# Altium schematic sheet ADS_2.SchDoc
size A
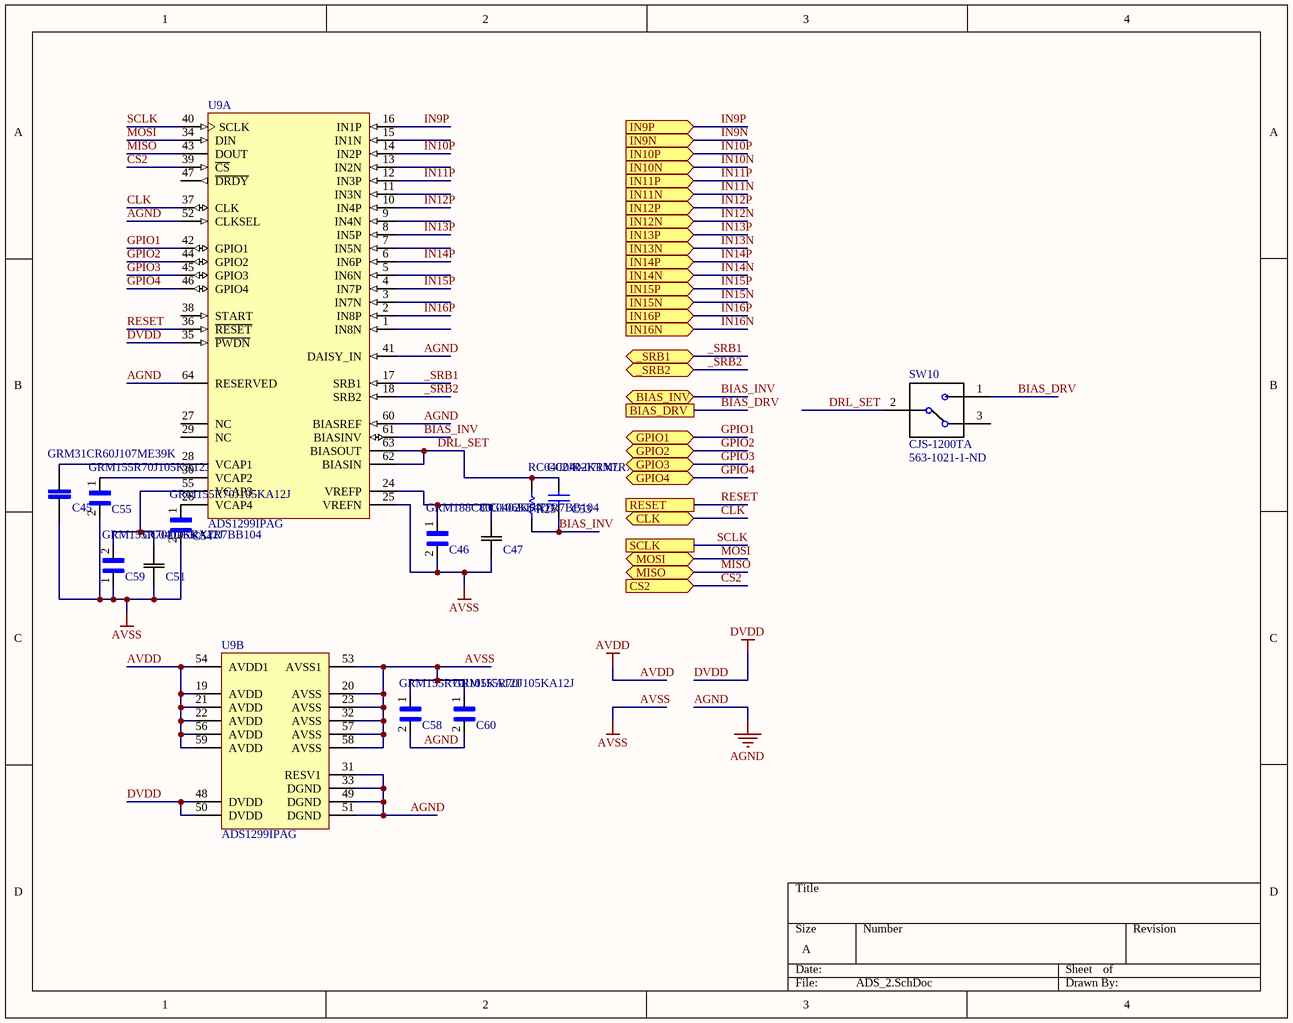
[diagram p0: ADS_2.SchDoc]

## Parts
C45  GRM31CR60J107ME39K  [*CAPC3216X190]
C46  GRM188C80G106KE47D  [*CAPC1608X90N]
C47  CC0402KRX7R7BB104  [YAG_CC0402]
C51  CC0402KRX7R7BB104  [YAG_CC0402]
C53  CC0402KRX7R7BB102  [CAPC1005X55X23NL05T08]
C54  GRM155R70J105KA12J  [*CAPC1005X55N]
C55  GRM155R70J105KA12J  [*CAPC1005X55N]
C58  GRM155R70J105KA12J  [*CAPC1005X55N]
C59  GRM155R70J105KA12J  [*CAPC1005X55N]
C60  GRM155R70J105KA12J  [*CAPC1005X55N]
R25  RC0402JR-071ML  [RESC1005X40X25NL05T10]
SW10  CJS-1200TA  Supplier Part Number 1: 563-1021-1-ND  [*SW_CJS-1200TA]
U9  ADS1299IPAG  [PAG0064A_N]  (parts A,B of 2)

## Ports
_SRB1 (bidir), _SRB2 (bidir), BIAS_DRV, BIAS_INV (bidir), CLK (bidir), CS2 (in), GPIO1 (bidir), GPIO2 (bidir), GPIO3 (bidir), GPIO4 (bidir), IN9N (in), IN9P (in), IN10N (in), IN10P (in), IN11N (in), IN11P (in), IN12N (in), IN12P (in), IN13N (in), IN13P (in), IN14N (in), IN14P (in), IN15N (in), IN15P (in), IN16N (in), IN16P (in), MISO (bidir), MOSI (bidir), RESET, SCLK

## Nets
AGND: C58.2 C60.2 U9.31(RESV1) U9.33(DGND) U9.41(DAISY_IN) U9.49(DGND) U9.51(DGND) U9.52(CLKSEL) U9.60(BIASREF) U9.64(RESERVED)
AVDD: U9.19(AVDD) U9.21(AVDD) U9.22(AVDD) U9.54(AVDD1) U9.56(AVDD) U9.59(AVDD)
AVSS: C45.2 C46.2 C47.2 C51.1 C54.2 C55.2 C58.1 C59.1 C60.1 U9.20(AVSS) U9.23(AVSS) U9.25(VREFN) U9.32(AVSS) U9.53(AVSS1) U9.57(AVSS) U9.58(AVSS)
DVDD: U9.35(~{PWDN}) U9.48(DVDD) U9.50(DVDD)
_SRB1: U9.17(SRB1) ; port _SRB1
_SRB2: U9.18(SRB2) ; port _SRB2
BIAS_DRV: SW10.1 ; port BIAS_DRV
BIAS_INV: C53.2 R25.2 U9.61(BIASINV) ; port BIAS_INV
CLK: U9.37(CLK) ; port CLK
CS2: U9.39(~{CS}) ; port CS2
DRL_SET: C53.1 R25.1 SW10.2 U9.62(BIASIN) U9.63(BIASOUT)
GPIO1: U9.42(GPIO1) ; port GPIO1
GPIO2: U9.44(GPIO2) ; port GPIO2
GPIO3: U9.45(GPIO3) ; port GPIO3
GPIO4: U9.46(GPIO4) ; port GPIO4
IN9N: port IN9N
IN9P: U9.16(IN1P) ; port IN9P
IN10N: port IN10N
IN10P: U9.14(IN2P) ; port IN10P
IN11N: port IN11N
IN11P: U9.12(IN3P) ; port IN11P
IN12N: port IN12N
IN12P: U9.10(IN4P) ; port IN12P
IN13N: port IN13N
IN13P: U9.8(IN5P) ; port IN13P
IN14N: port IN14N
IN14P: U9.6(IN6P) ; port IN14P
IN15N: port IN15N
IN15P: U9.4(IN7P) ; port IN15P
IN16N: port IN16N
IN16P: U9.2(IN8P) ; port IN16P
MISO: U9.43(DOUT) ; port MISO
MOSI: U9.34(DIN) ; port MOSI
RESET: U9.36(~{RESET}) ; port RESET
SCLK: U9.40(SCLK) ; port SCLK
NetC45_1: C45.1 U9.28(VCAP1)
NetC46_1: C46.1 C47.1 U9.24(VREFP)
NetC51_2: C51.2 C59.2 U9.55(VCAP3)
NetC54_1: C54.1 U9.26(VCAP4)
NetC55_1: C55.1 U9.30(VCAP2)

Not connected (* = marked no-connect by the designer): SW10 3; U9 1(IN8N) 3(IN7N) 5(IN6N) 7(IN5N) 9(IN4N) 11(IN3N) 13(IN2N) 15(IN1N) 27(NC) 29(NC) 38(START) 47(~{DRDY})

## Library data of the parts
C45 = GRM31CR60J107ME39K: MURATA - GRM31CR60J107ME39K - COND, 100µF, 6.3V, 20%, X5R, 1206; Capacitance: 100uF; Supplier 1: Digi-Key; Manufacturer 1: Murata; Manufacturer Part Number 1: GRM31CR60J107ME39K; Stock 1: 407390; Pricing 1: 1=0.98000, 10=0.77400, 100=0.58060, 500=0.43870, 1000=0.38709, 2500=0.36128 (USD); RoHS: Yes; Mount: Surface Mount; Case/Package: 1206; Case Code (Imperial): 1206; Case Code (Metric): 3216; Min Operating Temperature: -55°C; Max Operating Temperature: 85°C; Tolerance: 20%; Packaging: Tape and Reel; Package Quantity: 1; Voltage Rating: 6.3V; Dielectric: X5R; Termination: SMD/SMT; Voltage: 6.3V; Voltage Rating (DC): 6.3V; Length: 3.2mm; Height: 1.6mm; Width: 0.063inch; Thickness: 0.071inch; Depth: 1.6mm; Radiation Hardening: No; REACH SVHC: No SVHC; Lead Free: Lead Free; ComponentLink1URL: https://datasheet.ciiva.com/13246/product-13246228.pdf?src-supplier=Mouser; ComponentLink1Description: https://datasheet.ciiva.com/13246/product-13246228.pdf?src-supplier=Mouser; ComponentLink2URL: https://datasheet.ciiva.com/18697/grm31cr60j107me39-01-18697367.pdf?src-supplier=Digi-Key; ComponentLink2Description: https://datasheet.ciiva.com/18697/grm31cr60j107me39-01-18697367.pdf?src-supplier=Digi-Key; ComponentLink3URL: https://datasheet.ciiva.com/18697/grm31cr60j107me39-01-18697368.pdf?src-supplier=Digi-Key; ComponentLink3Description: https://datasheet.ciiva.com/18697/grm31cr60j107me39-01-18697368.pdf?src-supplier=Digi-Key; ComponentLink4URL: https://datasheet.ciiva.com/18697/grm31cr60j107me39-01-18697369.pdf?src-supplier=Digi-Key; ComponentLink4Description: https://datasheet.ciiva.com/18697/grm31cr60j107me39-01-18697369.pdf?src-supplier=Digi-Key; Supplier Part Number 1: 490-7217-1-ND
C46 = GRM188C80G106KE47D: CAP CER 10UF 4V X6S 0603; Manufacturer 1: Murata; Tolerance: 10%; Supplier 1: Digi-Key; Manufacturer Part Number 1: GRM188C80G106KE47D; Stock 1: 203819; Pricing 1: 1=0.17000, 10=0.11800, 100=0.05990, 500=0.04098, 1000=0.03625 (USD); RoHS: Yes; Mount: Surface Mount; Case/Package: 0603; Weight: 0.000222oz; Case Code (Metric): 1608; Case Code (Imperial): 0603; Min Operating Temperature: -55°C; Max Operating Temperature: 105°C; Capacitance: 10uF; Packaging: Tape and Reel; Voltage Rating: 4V; Dielectric: X6S; Termination: SMD/SMT; Voltage Rating (DC): 4V; Package Quantity: 4000; Length: 0.063inch; Height: 0.8mm; Width: 0.031inch; Thickness: 0.035inch; ComponentLink1URL: http://www.mouser.com/ds/2/281/c02e-2905.pdf?src-supplier=Mouser; ComponentLink1Description: http://www.mouser.com/ds/2/281/c02e-2905.pdf?src-supplier=Mouser; ComponentLink2URL: http://search.murata.co.jp/Ceramy/image/img/A01X/G101/ENG/GRM188C80G106KE47-01.pdf?src-supplier=Digi-Key; ComponentLink2Description: http://search.murata.co.jp/Ceramy/image/img/A01X/G101/ENG/GRM188C80G106KE47-01.pdf?src-supplier=Digi-Key; Supplier Part Number 1: 490-10469-1-ND
C47 C51 = CC0402KRX7R7BB104: CAP CER 0.1UF 16V X7R 0402; Manufacturer 1: Yageo; Capacitance: 100nF; Tolerance: 10%; Supplier 1: Digi-Key; Manufacturer Part Number 1: CC0402KRX7R7BB104; Stock 1: 30032352; Pricing 1: 1=0.10000, 10=0.03200, 100=0.01420, 500=0.01014, 1000=0.00797, 2500=0.00724, 5000=0.00667 (USD); RoHS: Yes; Mount: Surface Mount; Case/Package: 0402; Number of Pins: 2; Case Code (Metric): 1005; Case Code (Imperial): 0402; Min Operating Temperature: -55°C; Max Operating Temperature: 125°C; Voltage Rating: 16V; Voltage Rating (DC): 16V; Packaging: Tape and Reel; Package Quantity: 1; Dielectric: X7R; Termination: SMD/SMT; Composition: Ceramic; Voltage: 16V; Length: 1mm; Height: 0.5mm; Width: 0.02inch; Thickness: 0.022inch; Depth: 0.5mm; Radiation Hardening: No; REACH SVHC: No SVHC; Lead Free: Lead Free; Halogen Free: Halogen Free; ComponentLink1URL: https://datasheet.ciiva.com/11788/0900766b80ce67ed-11788364.pdf?src-supplier=RSComponents; ComponentLink1Description: https://datasheet.ciiva.com/11788/0900766b80ce67ed-11788364.pdf?src-supplier=RSComponents; ComponentLink2URL: https://datasheet.ciiva.com/16625/upy-gphc-x7r-6-3v-to-50v-8-16625511.pdf?src-supplier=Avnet+Europe; ComponentLink2Description: https://datasheet.ciiva.com/16625/upy-gphc-x7r-6-3v-to-50v-8-16625511.pdf?src-supplier=Avnet+Europe; ComponentLink3URL: https://datasheet.ciiva.com/161/mlccorderingcode-161544.pdf?src-supplier=Digi-Key; ComponentLink3Description: https://datasheet.ciiva.com/161/mlccorderingcode-161544.pdf?src-supplier=Digi-Key; ComponentLink4URL: https://datasheet.ciiva.com/161/mlccorderingcode-161545.pdf?src-supplier=Digi-Key; ComponentLink4Description: https://datasheet.ciiva.com/161/mlccorderingcode-161545.pdf?src-supplier=Digi-Key; ComponentLink5URL: https://datasheet.ciiva.com/8033/1734573-8033661.pdf?src-supplier=Element14; ComponentLink5Description: https://datasheet.ciiva.com/8033/1734573-8033661.pdf?src-supplier=Element14; ComponentLink6URL: https://datasheet.ciiva.com/7978/1489800-7978111.pdf?src-supplier=Element14; ComponentLink6Description: https://datasheet.ciiva.com/7978/1489800-7978111.pdf?src-supplier=Element14; ComponentLink7URL: https://datasheet.ciiva.com/8033/1734573-8033663.pdf?src-supplier=Element14; ComponentLink7Description: https://datasheet.ciiva.com/8033/1734573-8033663.pdf?src-supplier=Element14; ComponentLink8URL: https://datasheet.ciiva.com/11587/upy-gphc-x7r-6-3v-to-50v-8-11587305.pdf?src-supplier=Avnet; ComponentLink8Description: https://datasheet.ciiva.com/11587/upy-gphc-x7r-6-3v-to-50v-8-11587305.pdf?src-supplier=Avnet; ComponentLink9URL: https://datasheet.ciiva.com/161/mlccorderingcode-161546.pdf?src-supplier=Digi-Key; ComponentLink9Description: https://datasheet.ciiva.com/161/mlccorderingcode-161546.pdf?src-supplier=Digi-Key; ComponentLink10URL: https://datasheet.ciiva.com/13395/upy-gphc-x7r-6-3v-to-50v-8-13395676.pdf?src-supplier=Mouser; ComponentLink10Description: https://datasheet.ciiva.com/13395/upy-gphc-x7r-6-3v-to-50v-8-13395676.pdf?src-supplier=Mouser; ComponentLink11URL: https://datasheet.ciiva.com/28450/1489800-28450335.pdf?src-supplier=Element14; ComponentLink11Description: https://datasheet.ciiva.com/28450/1489800-28450335.pdf?src-supplier=Element14; Supplier Part Number 1: 311-1338-1-ND
C53 = CC0402KRX7R7BB102: CAP CER 1000PF 16V X7R 0402; Manufacturer 1: Yageo; Capacitance: 1nF; Tolerance: 10%; Supplier 1: Digi-Key; Manufacturer Part Number 1: CC0402KRX7R7BB102; Stock 1: 319318; Pricing 1: 1=0.10000, 10=0.02000, 100=0.00910, 500=0.00646, 1000=0.00508, 2500=0.00462, 5000=0.00425 (USD); RoHS: Yes; Mount: Surface Mount; Case/Package: 0402; Case Code (Imperial): 0402; Case Code (Metric): 1005; Min Operating Temperature: -55°C; Max Operating Temperature: 125°C; Packaging: Tape and Reel; Voltage Rating: 16V; Voltage Rating (DC): 16V; Package Quantity: 1; Dielectric: X7R; Termination: SMD/SMT; Composition: Ceramic; Length: 1mm; Height: 0.5mm; Width: 0.5mm; Thickness: 0.022inch; Depth: 0.5mm; Radiation Hardening: No; REACH SVHC: No SVHC; Lead Free: Lead Free; Halogen Free: Halogen Free; ComponentLink1URL: https://datasheet.ciiva.com/143/mlccorderingcode-143963.pdf?src-supplier=Digi-Key; ComponentLink1Description: https://datasheet.ciiva.com/143/mlccorderingcode-143963.pdf?src-supplier=Digi-Key; ComponentLink2URL: https://datasheet.ciiva.com/26862/getdatasheetpartid-698313-26862635.pdf?src-supplier=Verical; ComponentLink2Description: https://datasheet.ciiva.com/26862/getdatasheetpartid-698313-26862635.pdf?src-supplier=Verical; ComponentLink3URL: https://datasheet.ciiva.com/143/mlccorderingcode-143964.pdf?src-supplier=Digi-Key; ComponentLink3Description: https://datasheet.ciiva.com/143/mlccorderingcode-143964.pdf?src-supplier=Digi-Key; ComponentLink4URL: https://datasheet.ciiva.com/17437/upy-gphc-x7r-6-3v-to-50v-8-17437337.pdf?src-supplier=Avnet+Europe; ComponentLink4Description: https://datasheet.ciiva.com/17437/upy-gphc-x7r-6-3v-to-50v-8-17437337.pdf?src-supplier=Avnet+Europe; ComponentLink5URL: https://datasheet.ciiva.com/143/mlccorderingcode-143962.pdf?src-supplier=Digi-Key; ComponentLink5Description: https://datasheet.ciiva.com/143/mlccorderingcode-143962.pdf?src-supplier=Digi-Key; ComponentLink6URL: https://datasheet.ciiva.com/7978/1489800-7978107.pdf?src-supplier=Element14; ComponentLink6Description: https://datasheet.ciiva.com/7978/1489800-7978107.pdf?src-supplier=Element14; ComponentLink7URL: https://datasheet.ciiva.com/11464/upy-gphc-x7r-6-3v-to-50v-8-11464876.pdf?src-supplier=Avnet; ComponentLink7Description: https://datasheet.ciiva.com/11464/upy-gphc-x7r-6-3v-to-50v-8-11464876.pdf?src-supplier=Avnet; Supplier Part Number 1: 311-1352-1-ND
C54 C55 C58-C60 = GRM155R70J105KA12J: CAP CER 1UF 6.3V X7R 0402; Manufacturer 1: Murata; Tolerance: 10%; Supplier 1: Digi-Key; Manufacturer Part Number 1: GRM155R70J105KA12J; Stock 1: 3268614; Pricing 1: 1=0.11000, 10=0.07900, 100=0.03700, 500=0.02596, 1000=0.02149, 2500=0.02000, 5000=0.01830 (USD); RoHS: Yes; Mount: Surface Mount; Case/Package: 0402; Weight: 0.000212oz; Case Code (Metric): 1005; Case Code (Imperial): 0402; Min Operating Temperature: -55°C; Max Operating Temperature: 125°C; Packaging: Tape and Reel; Capacitance: 1uF; Voltage Rating: 6.3V; Dielectric: X7R; Termination: SMD/SMT; Voltage Rating (DC): 6.3V; Package Quantity: 50000; Length: 0.039inch; Width: 0.02inch; Thickness: 0.022inch; ComponentLink1URL: http://www.mouser.com/ds/2/281/c02e-2905.pdf?src-supplier=Mouser; ComponentLink1Description: http://www.mouser.com/ds/2/281/c02e-2905.pdf?src-supplier=Mouser; ComponentLink2URL: http://search.murata.co.jp/Ceramy/image/img/A01X/G101/ENG/GRM155R70J105KA12-01.pdf?src-supplier=Digi-Key; ComponentLink2Description: http://search.murata.co.jp/Ceramy/image/img/A01X/G101/ENG/GRM155R70J105KA12-01.pdf?src-supplier=Digi-Key; Supplier Part Number 1: 490-13339-1-ND
R25 = RC0402JR-071ML: RES SMD 1M OHM 5% 1/16W 0402; Manufacturer 1: Yageo; Resistance: 1MR; Power Rating: 62.5mW; Voltage Rating: 50V; Temperature Coefficient: 100ppm/°C; Max Power Dissipation: 63mW; Supplier 1: Digi-Key; Manufacturer Part Number 1: RC0402JR-071ML; Stock 1: 2568291; Pricing 1: 1=0.10000, 10=0.01300, 100=0.00550, 1000=0.00245, 2500=0.00212, 5000=0.00176 (USD); RoHS: Yes; Case/Package: 0402; Weight: 2.3E-05oz; Case Code (Metric): 1005; Case Code (Imperial): 0402; Min Operating Temperature: -55°C; Max Operating Temperature: 155°C; Package Quantity: 1; Tolerance: 5%; Packaging: Tape and Reel; Composition: Thick Film; Number of Terminations: 2; Termination: SMD/SMT; Military Standard: Not; Features: Moisture Resistant; Length: 1mm; Height: 0.016inch; Width: 0.02inch; Depth: 0.5mm; REACH SVHC: No SVHC; Lead Free: Lead Free; ComponentLink1URL: https://datasheet.ciiva.com/2452/pyu-r-int-thick-7-2452736.pdf?src-supplier=Digi-Key; ComponentLink1Description: https://datasheet.ciiva.com/2452/pyu-r-int-thick-7-2452736.pdf?src-supplier=Digi-Key; ComponentLink2URL: https://datasheet.ciiva.com/7983/1018594-7983560.pdf?src-supplier=Element14; ComponentLink2Description: https://datasheet.ciiva.com/7983/1018594-7983560.pdf?src-supplier=Element14; ComponentLink3URL: https://datasheet.ciiva.com/12577/pyu-rc0402-51-rohs-l-6-r-12577354.pdf?src-supplier=Mouser; ComponentLink3Description: https://datasheet.ciiva.com/12577/pyu-rc0402-51-rohs-l-6-r-12577354.pdf?src-supplier=Mouser; ComponentLink4URL: https://datasheet.ciiva.com/17085/pyu-rc0402-51-rohs-l-6-r-17085739.pdf?src-supplier=Future+Electronics; ComponentLink4Description: https://datasheet.ciiva.com/17085/pyu-rc0402-51-rohs-l-6-r-17085739.pdf?src-supplier=Future+Electronics; ComponentLink5URL: https://datasheet.ciiva.com/7850/1018594-7850172.pdf?src-supplier=Element14; ComponentLink5Description: https://datasheet.ciiva.com/7850/1018594-7850172.pdf?src-supplier=Element14; ComponentLink6URL: https://datasheet.ciiva.com/7850/1018594-7850173.pdf?src-supplier=Element14; ComponentLink6Description: https://datasheet.ciiva.com/7850/1018594-7850173.pdf?src-supplier=Element14; ComponentLink7URL: https://datasheet.ciiva.com/2452/pyu-r-int-thick-7-2452734.pdf?src-supplier=Digi-Key; ComponentLink7Description: https://datasheet.ciiva.com/2452/pyu-r-int-thick-7-2452734.pdf?src-supplier=Digi-Key; ComponentLink8URL: https://datasheet.ciiva.com/2452/pyu-r-int-thick-7-2452735.pdf?src-supplier=Digi-Key; ComponentLink8Description: https://datasheet.ciiva.com/2452/pyu-r-int-thick-7-2452735.pdf?src-supplier=Digi-Key; Supplier Part Number 1: 311-1.0MJRCT-ND
SW10 = CJS-1200TA: SWITCH SLIDE SPDT 100MA 6V; Manufacturer 1: Nidec Copal; Body Material: Polyphenylene; Number of Positions: 2; Electrical Life: 200Cycles; Max Voltage Rating (DC): 24V; Actuator Type: Slide (Standard); Washable: Yes; Supplier 1: Digi-Key; Manufacturer Part Number 1: CJS-1200TA; Stock 1: 72766; Pricing 1: 1=0.88000, 10=0.86000, 25=0.81000, 50=0.76040, 100=0.72730, 250=0.69428, 500=0.62814 (USD); RoHS: Yes; Mount: Surface Mount; Contact Material: Copper Alloy; Contact Plating: Gold; Min Operating Temperature: -40°C; Max Operating Temperature: 85°C; Packaging: Tape and Reel; Throw Configuration: SPDT; Voltage Rating (DC): 6V; Current Rating: 100mA; Termination: J-Hook; Orientation: Vertical; Length: 0.212inch; Radiation Hardening: No; Lead Free: Lead Free; ComponentLink1URL: https://datasheet.ciiva.com/2864/cjs-2864476.pdf?src-supplier=Digi-Key; ComponentLink1Description: https://datasheet.ciiva.com/2864/cjs-2864476.pdf?src-supplier=Digi-Key; ComponentLink2URL: https://datasheet.ciiva.com/2864/cjs-2864477.pdf?src-supplier=Digi-Key; ComponentLink2Description: https://datasheet.ciiva.com/2864/cjs-2864477.pdf?src-supplier=Digi-Key; ComponentLink3URL: https://datasheet.ciiva.com/2864/cjs-2864478.pdf?src-supplier=Digi-Key; ComponentLink3Description: https://datasheet.ciiva.com/2864/cjs-2864478.pdf?src-supplier=Digi-Key
U9 = ADS1299IPAG: IC AFE 24BIT 16KSPS LN 64TQFP; Manufacturer 1: Texas Instruments; Number of Channels: 8; Max Power Dissipation: 42mW; Max Supply Voltage: 5.25V; Interface: SPI; Resolution: 24b; Number of Bits: 24; Sampling Rate: 16KS/s; Operating Supply Current: 7.14mA; Signal to Noise Ratio (SNR): 121dB; Power Consumption: 41mW; Min Supply Voltage: 4.75V; Supplier 1: Digi-Key; Manufacturer Part Number 1: ADS1299IPAG; Stock 1: 447; Pricing 1: 1=55.18000, 10=51.83200, 25=50.16000, 100=46.48160 (USD); RoHS: Yes; Case/Package: TQFP; Number of Pins: 64; Contact Plating: Gold; Min Operating Temperature: -40°C; Max Operating Temperature: 85°C; Package Quantity: 160; Packaging: Rail/Tube; Number of Converters: 8; Conversion Rate: 16KS/s; Number of Inputs: 8; Number of A/D Converters: 8; Type: General Purpose; Radiation Hardening: No; Lead Free: Lead Free; REACH SVHC: No SVHC; ComponentLink1URL: https://datasheet.ciiva.com/13063/ads1299-224171-13063283.pdf?src-supplier=Mouser; ComponentLink1Description: https://datasheet.ciiva.com/13063/ads1299-224171-13063283.pdf?src-supplier=Mouser; ComponentLink2URL: https://datasheet.ciiva.com/26913/getdatasheetpartid-563195-26913237.pdf?src-supplier=Verical; ComponentLink2Description: https://datasheet.ciiva.com/26913/getdatasheetpartid-563195-26913237.pdf?src-supplier=Verical; ComponentLink3URL: https://datasheet.ciiva.com/6668/ads1299-6668469.pdf?src-supplier=Digi-Key; ComponentLink3Description: https://datasheet.ciiva.com/6668/ads1299-6668469.pdf?src-supplier=Digi-Key; Supplier Part Number 1: 296-35009-ND